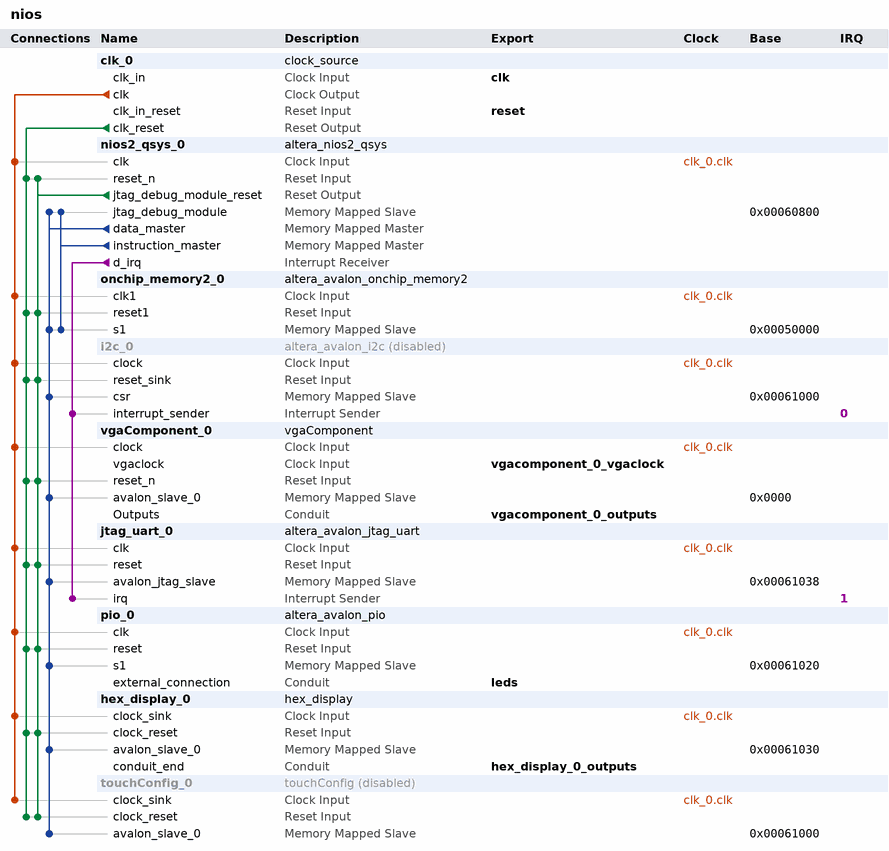
[diagram p0: system contents]
# Platform Designer (Qsys) system nios, Cyclone V 5CSEMA5F31C6
# Parameters at their usual value, and those the tool derives, are not listed.
package require -exact qsys 16.1
create_system nios
set_project_property DEVICE_FAMILY {Cyclone V}
set_project_property DEVICE 5CSEMA5F31C6

add_instance clk_0 clock_source 16.1
set_instance_parameter_value clk_0 clockFrequency 50000000

add_instance nios2_qsys_0 altera_nios2_qsys 16.1
set_instance_parameter_value nios2_qsys_0 breakSlave nios2_qsys_0.jtag_debug_module
set_instance_parameter_value nios2_qsys_0 exceptionSlave onchip_memory2_0.s1
set_instance_parameter_value nios2_qsys_0 icache_size 4096
set_instance_parameter_value nios2_qsys_0 impl Small
set_instance_parameter_value nios2_qsys_0 mmu_TLBMissExcSlave None
set_instance_parameter_value nios2_qsys_0 muldiv_divider true
set_instance_parameter_value nios2_qsys_0 resetSlave onchip_memory2_0.s1
set_instance_parameter_value nios2_qsys_0 resetrequest_enabled true

add_instance onchip_memory2_0 altera_avalon_onchip_memory2 16.1
set_instance_parameter_value onchip_memory2_0 dataWidth 32
set_instance_parameter_value onchip_memory2_0 dualPort false
set_instance_parameter_value onchip_memory2_0 initMemContent true
set_instance_parameter_value onchip_memory2_0 initializationFileName onchip_mem.hex
set_instance_parameter_value onchip_memory2_0 memorySize 65536

add_instance i2c_0 altera_avalon_i2c 16.1
set_instance_property i2c_0 ENABLED false
set_instance_parameter_value i2c_0 FIFO_DEPTH 4

add_instance vgaComponent_0 vgaComponent 1.0

add_instance jtag_uart_0 altera_avalon_jtag_uart 16.1
set_instance_parameter_value jtag_uart_0 simInteractiveOptions NO_INTERACTIVE_WINDOWS

add_instance pio_0 altera_avalon_pio 16.1
set_instance_parameter_value pio_0 direction Output
set_instance_parameter_value pio_0 width 10

add_instance hex_display_0 hex_display 1.0

add_instance touchConfig_0 touchConfig 1.0
set_instance_property touchConfig_0 ENABLED false

# connections
add_connection clk_0.clk hex_display_0.clock_sink clock
add_connection clk_0.clk i2c_0.clock clock
add_connection clk_0.clk jtag_uart_0.clk clock
add_connection clk_0.clk nios2_qsys_0.clk clock
add_connection clk_0.clk onchip_memory2_0.clk1 clock
add_connection clk_0.clk pio_0.clk clock
add_connection clk_0.clk touchConfig_0.clock_sink clock
add_connection clk_0.clk vgaComponent_0.clock clock
add_connection clk_0.clk_reset hex_display_0.clock_reset reset
add_connection clk_0.clk_reset i2c_0.reset_sink reset
add_connection clk_0.clk_reset jtag_uart_0.reset reset
add_connection clk_0.clk_reset nios2_qsys_0.reset_n reset
add_connection clk_0.clk_reset onchip_memory2_0.reset1 reset
add_connection clk_0.clk_reset pio_0.reset reset
add_connection clk_0.clk_reset touchConfig_0.clock_reset reset
add_connection clk_0.clk_reset vgaComponent_0.reset_n reset
add_connection nios2_qsys_0.jtag_debug_module_reset hex_display_0.clock_reset reset
add_connection nios2_qsys_0.jtag_debug_module_reset i2c_0.reset_sink reset
add_connection nios2_qsys_0.jtag_debug_module_reset jtag_uart_0.reset reset
add_connection nios2_qsys_0.jtag_debug_module_reset nios2_qsys_0.reset_n reset
add_connection nios2_qsys_0.jtag_debug_module_reset onchip_memory2_0.reset1 reset
add_connection nios2_qsys_0.jtag_debug_module_reset pio_0.reset reset
add_connection nios2_qsys_0.jtag_debug_module_reset touchConfig_0.clock_reset reset
add_connection nios2_qsys_0.jtag_debug_module_reset vgaComponent_0.reset_n reset
add_connection nios2_qsys_0.data_master hex_display_0.avalon_slave_0 avalon
set_connection_parameter_value nios2_qsys_0.data_master/hex_display_0.avalon_slave_0 baseAddress 0x00061030
add_connection nios2_qsys_0.data_master i2c_0.csr avalon
set_connection_parameter_value nios2_qsys_0.data_master/i2c_0.csr baseAddress 0x00061000
add_connection nios2_qsys_0.data_master jtag_uart_0.avalon_jtag_slave avalon
set_connection_parameter_value nios2_qsys_0.data_master/jtag_uart_0.avalon_jtag_slave baseAddress 0x00061038
add_connection nios2_qsys_0.data_master nios2_qsys_0.jtag_debug_module avalon
set_connection_parameter_value nios2_qsys_0.data_master/nios2_qsys_0.jtag_debug_module baseAddress 0x00060800
add_connection nios2_qsys_0.data_master onchip_memory2_0.s1 avalon
set_connection_parameter_value nios2_qsys_0.data_master/onchip_memory2_0.s1 baseAddress 0x00050000
add_connection nios2_qsys_0.data_master pio_0.s1 avalon
set_connection_parameter_value nios2_qsys_0.data_master/pio_0.s1 baseAddress 0x00061020
add_connection nios2_qsys_0.data_master touchConfig_0.avalon_slave_0 avalon
set_connection_parameter_value nios2_qsys_0.data_master/touchConfig_0.avalon_slave_0 baseAddress 0x00061000
add_connection nios2_qsys_0.data_master vgaComponent_0.avalon_slave_0 avalon
set_connection_parameter_value nios2_qsys_0.data_master/vgaComponent_0.avalon_slave_0 baseAddress 0x0000
add_connection nios2_qsys_0.instruction_master nios2_qsys_0.jtag_debug_module avalon
set_connection_parameter_value nios2_qsys_0.instruction_master/nios2_qsys_0.jtag_debug_module baseAddress 0x00060800
add_connection nios2_qsys_0.instruction_master onchip_memory2_0.s1 avalon
set_connection_parameter_value nios2_qsys_0.instruction_master/onchip_memory2_0.s1 baseAddress 0x00050000
add_connection nios2_qsys_0.d_irq i2c_0.interrupt_sender interrupt
set_connection_parameter_value nios2_qsys_0.d_irq/i2c_0.interrupt_sender irqNumber 0
add_connection nios2_qsys_0.d_irq jtag_uart_0.irq interrupt
set_connection_parameter_value nios2_qsys_0.d_irq/jtag_uart_0.irq irqNumber 1

# exported interfaces
add_interface clk clock sink
set_interface_property clk EXPORT_OF clk_0.clk_in
add_interface hex_display_0_outputs conduit end
set_interface_property hex_display_0_outputs EXPORT_OF hex_display_0.conduit_end
add_interface leds conduit end
set_interface_property leds EXPORT_OF pio_0.external_connection
add_interface reset reset sink
set_interface_property reset EXPORT_OF clk_0.clk_in_reset
add_interface vgacomponent_0_outputs conduit end
set_interface_property vgacomponent_0_outputs EXPORT_OF vgaComponent_0.Outputs
add_interface vgacomponent_0_vgaclock clock sink
set_interface_property vgacomponent_0_vgaclock EXPORT_OF vgaComponent_0.vgaclock

set_interconnect_requirement {$system} qsys_mm.clockCrossingAdapter HANDSHAKE
set_interconnect_requirement {$system} qsys_mm.enableEccProtection FALSE
set_interconnect_requirement {$system} qsys_mm.insertDefaultSlave FALSE
set_interconnect_requirement {$system} qsys_mm.maxAdditionalLatency 1

save_system nios.qsys
